# Altium schematic sheet CON_ADCx4_KMRJIO3_5MM_6WAY.SchDoc: Screw Header For ADC
size A4; Organization: Altium Limited.; Address1: Level 3, 12a Rodborough Rd; Address2: Frenchs Forest 2086; Address3: NSW; Address4: AUSTRALIA; DocumentNumber: 12; SheetNumber: 13; SheetTotal: 77
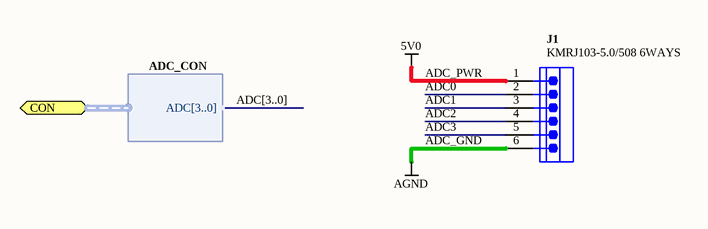
[diagram p0: CON_ADCx4_KMRJIO3_5MM_6WAY.SchDoc]

## Parts
J1  KMRJ103-5.0/508 6WAYS  [KMRJ103-5-508-6]

## Ports
CON (harness ADC_CON)

## Harnesses
ADC_CON: ADC[3..0]

## Nets
ADC_GND: J1.6  [also labelled AGND]
ADC_PWR: J1.1  [also labelled 5V0]
ADC0: J1.2
ADC1: J1.3
ADC2: J1.4
ADC3: J1.5

## Buses and harness runs
bus ADC[3..0]

## Notes on the sheet
- Sheet Title
- Project Title
- Size:
- Date:
- A4
- Assy:
- Time:
- Revision:
- Sheet
- of
- File:

## Library data of the parts
J1 = D-300-0122: Socket, Screw Terminal Block, 6 Way, 5.0mm pitch, 45 degree angle, Through-hole; Connector type: Header; Max Current: 300V/10A A; Mounting Technology: Through-Hole; Pin Count: 6; Status: Unreleased; Category: Connector